# Altium project cam_FX3.PrjPcb
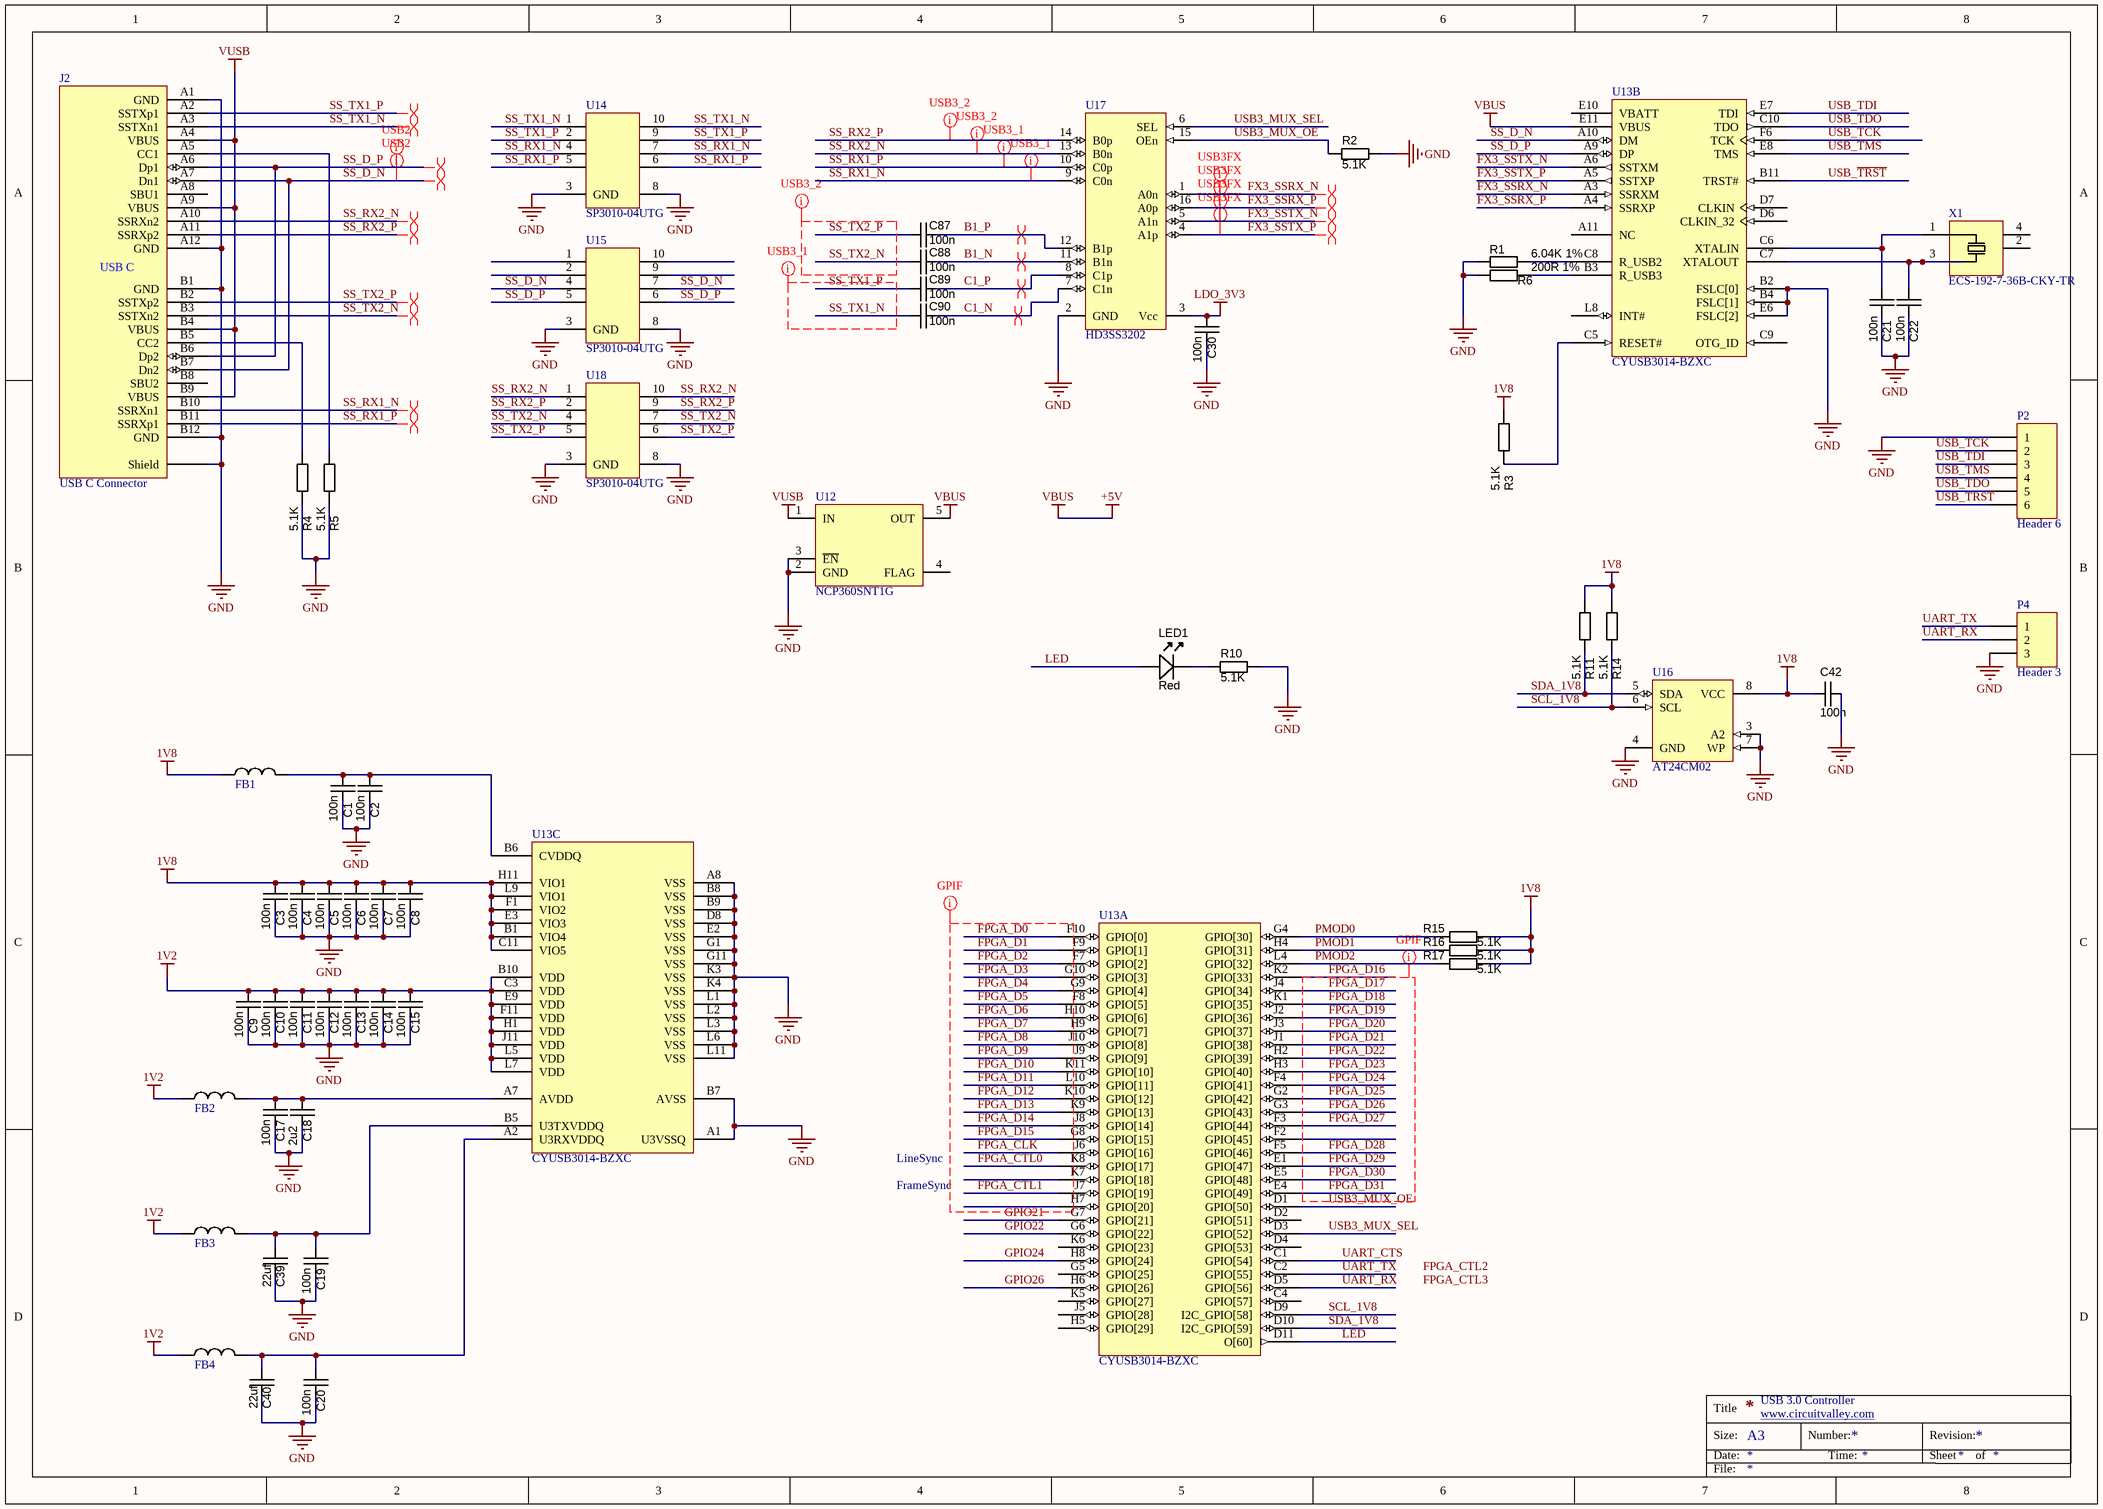
[diagram p0: usb.SchDoc]
3 sheets, 79 parts. Net scope: global (net labels, ports and power ports of the same name join across sheets).
Board file: cam_FX3.PcbDoc
Sheets:
  usb.SchDoc
  power.SchDoc
  camera.SchDoc

## Sheet usb.SchDoc
size A3

### Parts
C1  100n  [CAPC1005N]
C2  100n  [CAPC1005N]
C3  100n  [CAPC1005N]
C4  100n  [CAPC1005N]
C5  100n  [CAPC1005N]
C6  100n  [CAPC1005N]
C7  100n  [CAPC1005N]
C8  100n  [CAPC1005N]
C9  100n  [CAPC1005N]
C10  100n  [CAPC1005N]
C11  100n  [CAPC1005N]
C12  100n  [CAPC1005N]
C13  100n  [CAPC1005N]
C14  100n  [CAPC1005N]
C15  100n  [CAPC1005N]
C17  100n  [CAPC1005N]
C18  2u2  [CAPC1005N]
C19  100n  [CAPC1005N]
C20  100n  [CAPC1005N]
C21  100n  [CAPC1005N]
C22  100n  [CAPC1005N]
C30  100n  [CAPC1005N]
C39  value 22uf  [CAPC1608N]  (hidden comment: approved sub OK)
C40  value 22uf  [CAPC1608N]  (hidden comment: approved sub OK)
C42  100n  [CAPC1005N]
C87  100n  [CAPC1005N]
C88  100n  [CAPC1005N]
C89  100n  [CAPC1005N]
C90  100n  [CAPC1005N]
FB1  Ferrite  [INDC1608N]  (value not drawn)
FB2  Ferrite  [INDC1608N]  (value not drawn)
FB3  Ferrite  [INDC1608N]  (value not drawn)
FB4  Ferrite  [INDC1608N]  (value not drawn)
J2  USB C Connector  [10132328-10001LF]
LED1  Red  [LED-0603-RED]
P2  Header 6  [SMD_Solder_points_1.27]
P4  Header 3  [SMD_3Solder_points_1.27]
R1  value 6.04K 1%  [RESC1005N]  (hidden comment: 6.04K)
R2  value 5.1K  [RESC1005N]  (hidden comment: Thick Film)
R3  value 5.1K  [RESC1005N]  (hidden comment: Thick Film)
R4  value 5.1K  [RESC1005N]  (hidden comment: Thick Film)
R5  value 5.1K  [RESC1005N]  (hidden comment: Thick Film)
R6  value 200R 1%  [RESC1005N]  (hidden comment: 6.04K)
R10  value 5.1K  [RESC1005N]  (hidden comment: Thick Film)
R11  value 5.1K  [RESC1005N]  (hidden comment: Thick Film)
R14  value 5.1K  [RESC1005N]  (hidden comment: Thick Film)
R15  value 5.1K  [RESC1005N]  (hidden comment: Thick Film)
R16  value 5.1K  [RESC1005N]  (hidden comment: Thick Film)
R17  value 5.1K  [RESC1005N]  (hidden comment: Thick Film)
U12  NCP360SNT1G  [SOT23-5]
U13  CYUSB3014-BZXC  [CYP-BZX121]  (parts A,B,C of 3)
U14  SP3010-04UTG  [uDFN-10]
U15  SP3010-04UTG  [uDFN-10]
U16  AT24CM02  [SOIC8]
U17  HD3SS3202  [UQFN-16]
U18  SP3010-04UTG  [uDFN-10]
X1  ECS-192-7-36B-CKY-TR  [Active Oscillator 2520]

### Nets
1V2: C9.2 C10.2 C11.2 C12.2 C13.2 C14.2 C15.2 FB2.1 FB3.1 FB4.1 U13.B10(VDD) U13.C3(VDD) U13.E9(VDD) U13.F11(VDD) U13.H1(VDD) U13.J11(VDD) U13.L5(VDD) U13.L7(VDD)
1V8: C3.2 C4.2 C5.2 C6.2 C7.2 C8.2 C42.2 FB1.1 R3.1 R11.1 R14.1 R15.2 R16.2 R17.2 U13.B1(VIO4) U13.C11(VIO5) U13.E3(VIO3) U13.F1(VIO2) U13.H11(VIO1) U13.L9(VIO1) U16.8(VCC)
+5V: U12.5(OUT) U13.E11(VBUS)  [also labelled VBUS]
GND: C1.1 C2.1 C3.1 C4.1 C5.1 C6.1 C7.1 C8.1 C9.1 C10.1 C11.1 C12.1 C13.1 C14.1 C15.1 C17.1 C18.1 C19.1 C20.1 C21.2 C22.2 C30.1 C39.2 C40.2 C42.1 J2.0(Shield) J2.A1(GND) J2.A12(GND) J2.B1(GND) J2.B12(GND) P2.1 P4.3 R1.1 R2.2 R4.2 R5.2 R6.1 R10.2 U12.2(GND) U12.3(~{EN}) U13.A1(U3VSSQ) U13.A8(VSS) U13.B2(FSLC[0]) U13.B4(FSLC[1]) U13.B7(AVSS) U13.B8(VSS) U13.B9(VSS) U13.D8(VSS) U13.E2(VSS) U13.E6(FSLC[2]) U13.G1(VSS) U13.G11(VSS) U13.K3(VSS) U13.K4(VSS) U13.L1(VSS) U13.L2(VSS) U13.L3(VSS) U13.L6(VSS) U13.L11(VSS) U14.3(GND) U14.8(GND) U15.3(GND) U15.8(GND) U16.3(A2) U16.4(GND) U16.7(WP) U17.2(GND) U18.3(GND) U18.8(GND)
LDO_3V3: C30.2 U17.3(Vcc)
VUSB: J2.A4(VBUS) J2.A9(VBUS) J2.B4(VBUS) J2.B9(VBUS) U12.1(IN)
B1_N: C88.2 U17.11(B1n)
B1_P: C87.2 U17.12(B1p)
C1_N: C90.2 U17.7(C1n)
C1_P: C89.2 U17.8(C1p)
FPGA_CLK: U13.J6(GPIO[16])
FPGA_CTL0: U13.K8(GPIO[17])
FPGA_CTL1: U13.J7(GPIO[19])
FPGA_D0: U13.F10(GPIO[0])
FPGA_D1: U13.F9(GPIO[1])
FPGA_D2: U13.F7(GPIO[2])
FPGA_D3: U13.G10(GPIO[3])
FPGA_D4: U13.G9(GPIO[4])
FPGA_D5: U13.F8(GPIO[5])
FPGA_D6: U13.H10(GPIO[6])
FPGA_D7: U13.H9(GPIO[7])
FPGA_D8: U13.J10(GPIO[8])
FPGA_D9: U13.J9(GPIO[9])
FPGA_D10: U13.K11(GPIO[10])
FPGA_D11: U13.L10(GPIO[11])
FPGA_D12: U13.K10(GPIO[12])
FPGA_D13: U13.K9(GPIO[13])
FPGA_D14: U13.J8(GPIO[14])
FPGA_D15: U13.G8(GPIO[15])
FPGA_D16: U13.K2(GPIO[33])
FPGA_D17: U13.J4(GPIO[34])
FPGA_D18: U13.K1(GPIO[35])
FPGA_D19: U13.J2(GPIO[36])
FPGA_D20: U13.J3(GPIO[37])
FPGA_D21: U13.J1(GPIO[38])
FPGA_D22: U13.H2(GPIO[39])
FPGA_D23: U13.H3(GPIO[40])
FPGA_D24: U13.F4(GPIO[41])
FPGA_D25: U13.G2(GPIO[42])
FPGA_D26: U13.G3(GPIO[43])
FPGA_D27: U13.F3(GPIO[44])
FPGA_D28: U13.F5(GPIO[46])
FPGA_D29: U13.E1(GPIO[47])
FPGA_D30: U13.E5(GPIO[48])
FPGA_D31: U13.E4(GPIO[49])
FX3_SSRX_N: U13.A3(SSRXM) U17.1(A0n)
FX3_SSRX_P: U13.A4(SSRXP) U17.16(A0p)
FX3_SSTX_N: U13.A6(SSTXM) U17.5(A1n)
FX3_SSTX_P: U13.A5(SSTXP) U17.4(A1p)
GPIO21: U13.G7(GPIO[21])
GPIO22: U13.G6(GPIO[22])
GPIO24: U13.H8(GPIO[24])
GPIO26: U13.H6(GPIO[26])
LED: LED1.A U13.D11(O[60])
PMOD0: R15.1 U13.G4(GPIO[30])
PMOD1: R16.1 U13.H4(GPIO[31])
PMOD2: R17.1 U13.L4(GPIO[32])
SCL_1V8: R14.2 U13.D9(I2C_GPIO[58]) U16.6(SCL)
SDA_1V8: R11.2 U13.D10(I2C_GPIO[59]) U16.5(SDA)
SS_D_N: J2.A7(Dn1) J2.B7(Dn2) U13.A10(DM) U15.4 U15.7
SS_D_P: J2.A6(Dp1) J2.B6(Dp2) U13.A9(DP) U15.5 U15.6
SS_RX1_N: J2.B10(SSRXn1) U14.4 U14.7 U17.9(C0n)
SS_RX1_P: J2.B11(SSRXp1) U14.5 U14.6 U17.10(C0p)
SS_RX2_N: J2.A10(SSRXn2) U17.13(B0n) U18.1 U18.10
SS_RX2_P: J2.A11(SSRXp2) U17.14(B0p) U18.2 U18.9
SS_TX1_N: C90.1 J2.A3(SSTXn1) U14.1 U14.10
SS_TX1_P: C89.1 J2.A2(SSTXp1) U14.2 U14.9
SS_TX2_N: C88.1 J2.B3(SSTXn2) U18.4 U18.7
SS_TX2_P: C87.1 J2.B2(SSTXp2) U18.5 U18.6
UART_CTS: U13.C1(GPIO[54])
UART_RX: P4.2 U13.D5(GPIO[56])
UART_TX: P4.1 U13.C2(GPIO[55])
USB3_MUX_OE: R2.1 U13.D1(GPIO[50]) U17.15(OEn)
USB3_MUX_SEL: U13.D3(GPIO[52]) U17.6(SEL)
USB_~{TRST}: P2.6 U13.B11(TRST#)
USB_TCK: P2.2 U13.F6(TCK)
USB_TDI: P2.3 U13.E7(TDI)
USB_TDO: P2.5 U13.C10(TDO)
USB_TMS: P2.4 U13.E8(TMS)
NetC1_2: C1.2 C2.2 FB1.2 U13.B6(CVDDQ)
NetC17_2: C17.2 C18.2 FB2.2 U13.A7(AVDD)
NetC19_2: C19.2 C39.1 FB3.2 U13.B5(U3TXVDDQ)
NetC20_2: C20.2 C40.1 FB4.2 U13.A2(U3RXVDDQ)
NetC21_1: C21.1 U13.C6(XTALIN) X1.1(X1)
NetC22_1: C22.1 U13.C7(XTALOUT) X1.3(X2)
NetJ2_A5: J2.A5(CC1) R5.1
NetJ2_B5: J2.B5(CC2) R4.1
NetLED1_K: LED1.K R10.1
NetR1_2: R1.2 U13.C8(R_USB2)
NetR3_2: R3.2 U13.C5(RESET#)
NetR6_2: R6.2 U13.B3(R_USB3)

Not connected (* = marked no-connect by the designer): J2 A8(SBU1) B8(SBU2); U12 4(FLAG); U13 A11(NC) C4(GPIO[57]) C9(OTG_ID) D2(GPIO[51]) D4(GPIO[53]) D6(CLKIN_32) D7(CLKIN) E10(VBATT) F2(GPIO[45]) G5(GPIO[25]) H5(GPIO[29]) H7(GPIO[20]) J5(GPIO[28]) K5(GPIO[27]) K6(GPIO[23]) K7(GPIO[18]) L8(INT#); U15 1 2 9 10; X1 2(NC) 4(NC)

### Layout directives
differential pair: B1_N, B1_P, C1_N, C1_P, FX3_SSRX_N, FX3_SSRX_P, FX3_SSTX_N, FX3_SSTX_P, SS_D_N, SS_D_P, SS_RX1_N, SS_RX1_P, SS_RX2_N, SS_RX2_P, SS_TX1_N, SS_TX1_P, SS_TX2_N, SS_TX2_P
net class USB2: SS_D_N, SS_D_P
net class USB3FX: FX3_SSRX_N, FX3_SSRX_P, FX3_SSTX_N, FX3_SSTX_P
net class USB3_2: SS_RX2_N, SS_RX2_P, SS_TX2_N, SS_TX2_P
net class USB3_1: SS_RX1_N, SS_RX1_P, SS_TX1_N, SS_TX1_P
net class GPIF: FPGA_CLK, FPGA_CTL0, FPGA_CTL1, FPGA_D0, FPGA_D1, FPGA_D2, FPGA_D3, FPGA_D4, FPGA_D5, FPGA_D6, FPGA_D7, FPGA_D8, FPGA_D9, FPGA_D10, FPGA_D11, FPGA_D12, FPGA_D13, FPGA_D14, FPGA_D15, FPGA_D16, FPGA_D17, FPGA_D18, FPGA_D19, FPGA_D20, FPGA_D21, FPGA_D22, FPGA_D23, FPGA_D24, FPGA_D25, FPGA_D26, FPGA_D27, FPGA_D28, FPGA_D29, FPGA_D30, FPGA_D31

### Notes on the sheet
- LineSync
- FrameSync
- USB 3.0 Controller
- www.circuitvalley.com <http://www.circuitvalley.com>
- Labels drawn without touching a wire or pin: FPGA_CTL2, FPGA_CTL3
- Title
- Size:
- Date:
- A3
- Number:
- Time:
- Revision:
- Sheet
- of
- File:
- (in symbol USB_C) USB C

### Library data of the parts
C1-C15 C17-C22 C30 C42 C87-C90 = CAPC_10n_0402_16V_10%: Capacitor SMD Cer 10nF 10% 16V X7R 0402; Manufacturer 1: AVX Corporation; Manufacturer Part Number 1: 0402YC103KAT2A; Ratings: 16V; X7R; Tolerance: ±10%; Operating Temperature: -55°C ~ 125°C; Package / Case: 0402 (1005 Metric); Size / Dimension: 0.039" L x 0.020" W (1.00mm x 0.50mm); Manufacturer 2: Yageo; Manufacturer Part Number 2: CC0402KRX7R7BB103; Supplier 1: Digi-Key; Supplier Part Number 1: 478-1114-1-ND; ComponentLink1URL: http://www.avx.com/docs/Catalogs/cx7r.pdf; ComponentLink1Description: http://www.avx.com/docs/Catalogs/cx7r.pdf; Supplier 2: Digi-Key; Supplier Part Number 2: 311-1042-1-ND; ComponentLink2URL: http://www.yageo.com/documents/recent/UPY-GPHC_X7R_6.3V-to-50V_8.pdf; ComponentLink2Description: http://www.yageo.com/documents/recent/UPY-GPHC_X7R_6.3V-to-50V_8.pdf
  C1-C15 C17 C19-C22 C30 C42 C87-C90: Value: 100n
  C18: Value: 2u2
C39 C40 = CAPC_560p_0603_5%: Capacitor SMD Cer 560pF 5% 50V NP0 0603; Manufacturer 1: AVX Corporation; Manufacturer Part Number 1: 06035A561JAT2A; Ratings: 50V; NP0; Material: ceramic; Capacitance: 470pF; Package / Case: 0603 (1608 metric); Voltage - Rated: 50V; Mounting Type: Surface Mount, MLCC; Operating Temperature: -55°C ~ 125°C; Applications: General Purpose; Size / Dimension: 0.063" L x 0.032" W (1.60mm x 0.81mm); Height - Seated (Max): -; Thickness (Max): 0.035" (0.90mm); Lead Spacing: -; Lead Style: -; ComponentLink1URL: http://www.avx.com/docs/Catalogs/ccog.pdf; ComponentLink1Description: http://www.avx.com/docs/Catalogs/ccog.pdf; Supplier 1: Digi-Key; Supplier Part Number 1: 478-1184-1-ND
J2 = USB_C
LED1 = LED_SMD_Red_0603_220mcd: LED 0603 SMD Hyper Red 630nm 220mcd 20mA; Manufacturer 1: Kingbright Corp; Manufacturer Part Number 1: APT1608SURCK; Material: AlGaInP on GaAs; Ratings: 220 mcd; 630 nm; Voltage - Forward (Vf) Typ: 1.95V; Voltage - Forward (Vf) @ 10mA: 1.9V; Package / Case: 0603 (1608 metric); Supplier 1: Digi-Key; Supplier Part Number 1: 754-1123-1-ND
P2 = Header 6: Header, 6-Pin; LatestRevisionDate: 17-Jul-2002; LatestRevisionNote: Re-released for DXP Platform.; Publisher: Altium Limited
P4 = Header 3: Header, 3-Pin; LatestRevisionDate: 17-Jul-2002; LatestRevisionNote: Re-released for DXP Platform.; Publisher: Altium Limited
R1-R6 R10 R11 R14-R17 = RES_3K3_0402_5%: Resistor SMD chip 3.3k Ohm 0.063W 5% 0402; Manufacturer 1: Yageo; Manufacturer Part Number 1: RC0402JR-073K3L; Ratings: 1/16 W; Package / Case: 0402 (1005 metric); Tolerance: ±5%; Material: Thick Film; Supplier 1: Digi-Key; Supplier Part Number 1: 311-3.3KJRCT-ND; ComponentLink1URL: http://www.yageo.com/documents/recent/PYu-RC0402_51_RoHS_L_6.pdf; ComponentLink1Description: http://www.yageo.com/documents/recent/PYu-RC0402_51_RoHS_L_6.pdf
U12 = NCP360SNT1G: USB Overvoltage Protection
U13 = CYUSB3014-BZXC: EZ-USB(R) FX3: SuperSpeed USB Controller, 512 KB, 60 I/Os, 0 to 70 degC, 121-Pin FBGA (BZX121); Manufacturer: Cypress; CPU Core: ARM926 EJ-S; Max. Operating Voltage (V): 1.25; Memory Architecture: SRAM; Memory Size (KB): 512; Min. Operating Voltage (V): 1.15; No. of I/Os: 60; DatasheetVersion: Rev. *O; PackageVersion: Rev. *D; PackageReference: BZX121; PackageDescription: 121-Ball FBGA, Body 10 x 10 mm, Pitch 0.8 mm; Supplier 1: Digi-Key; Supplier Part Number 1: 428-3182-ND; Supplier 2: Farnell; Supplier Part Number 2: 2355789; Supplier 3: Newark; Supplier Part Number 3: 54W7901; Supplier 4: Mouser; Supplier Part Number 4: 727-CYUSB3014-BZXC; Max. Operating Temp. (degreesC): 70; Min. Operating Temp. (degreesC): 0; RoHS: Pb-Free; Mounting Technology: Surface Mount; Code_JEDEC: PUB 95; PartNumber: CYUSB3014-BZXC; ComponentLink1Description: Manufacturer URL; ComponentLink1URL: http://www.cypress.com/; ComponentLink2Description: Datasheet; ComponentLink2URL: http://www.cypress.com/?docID=49087; ComponentLink3Description: Package Specification; ComponentLink3URL: http://www.cypress.com/?docID=45795
U14 U15 U18 = SP3010-04UTG: ESD Protection
U16 = AT24CM02: 2Mbit I2C EEPROM
U17 = HD3SS3202: USB 3.0 Mux
X1 = Crystal: Crystal Oscillator

## Sheet power.SchDoc
size A3
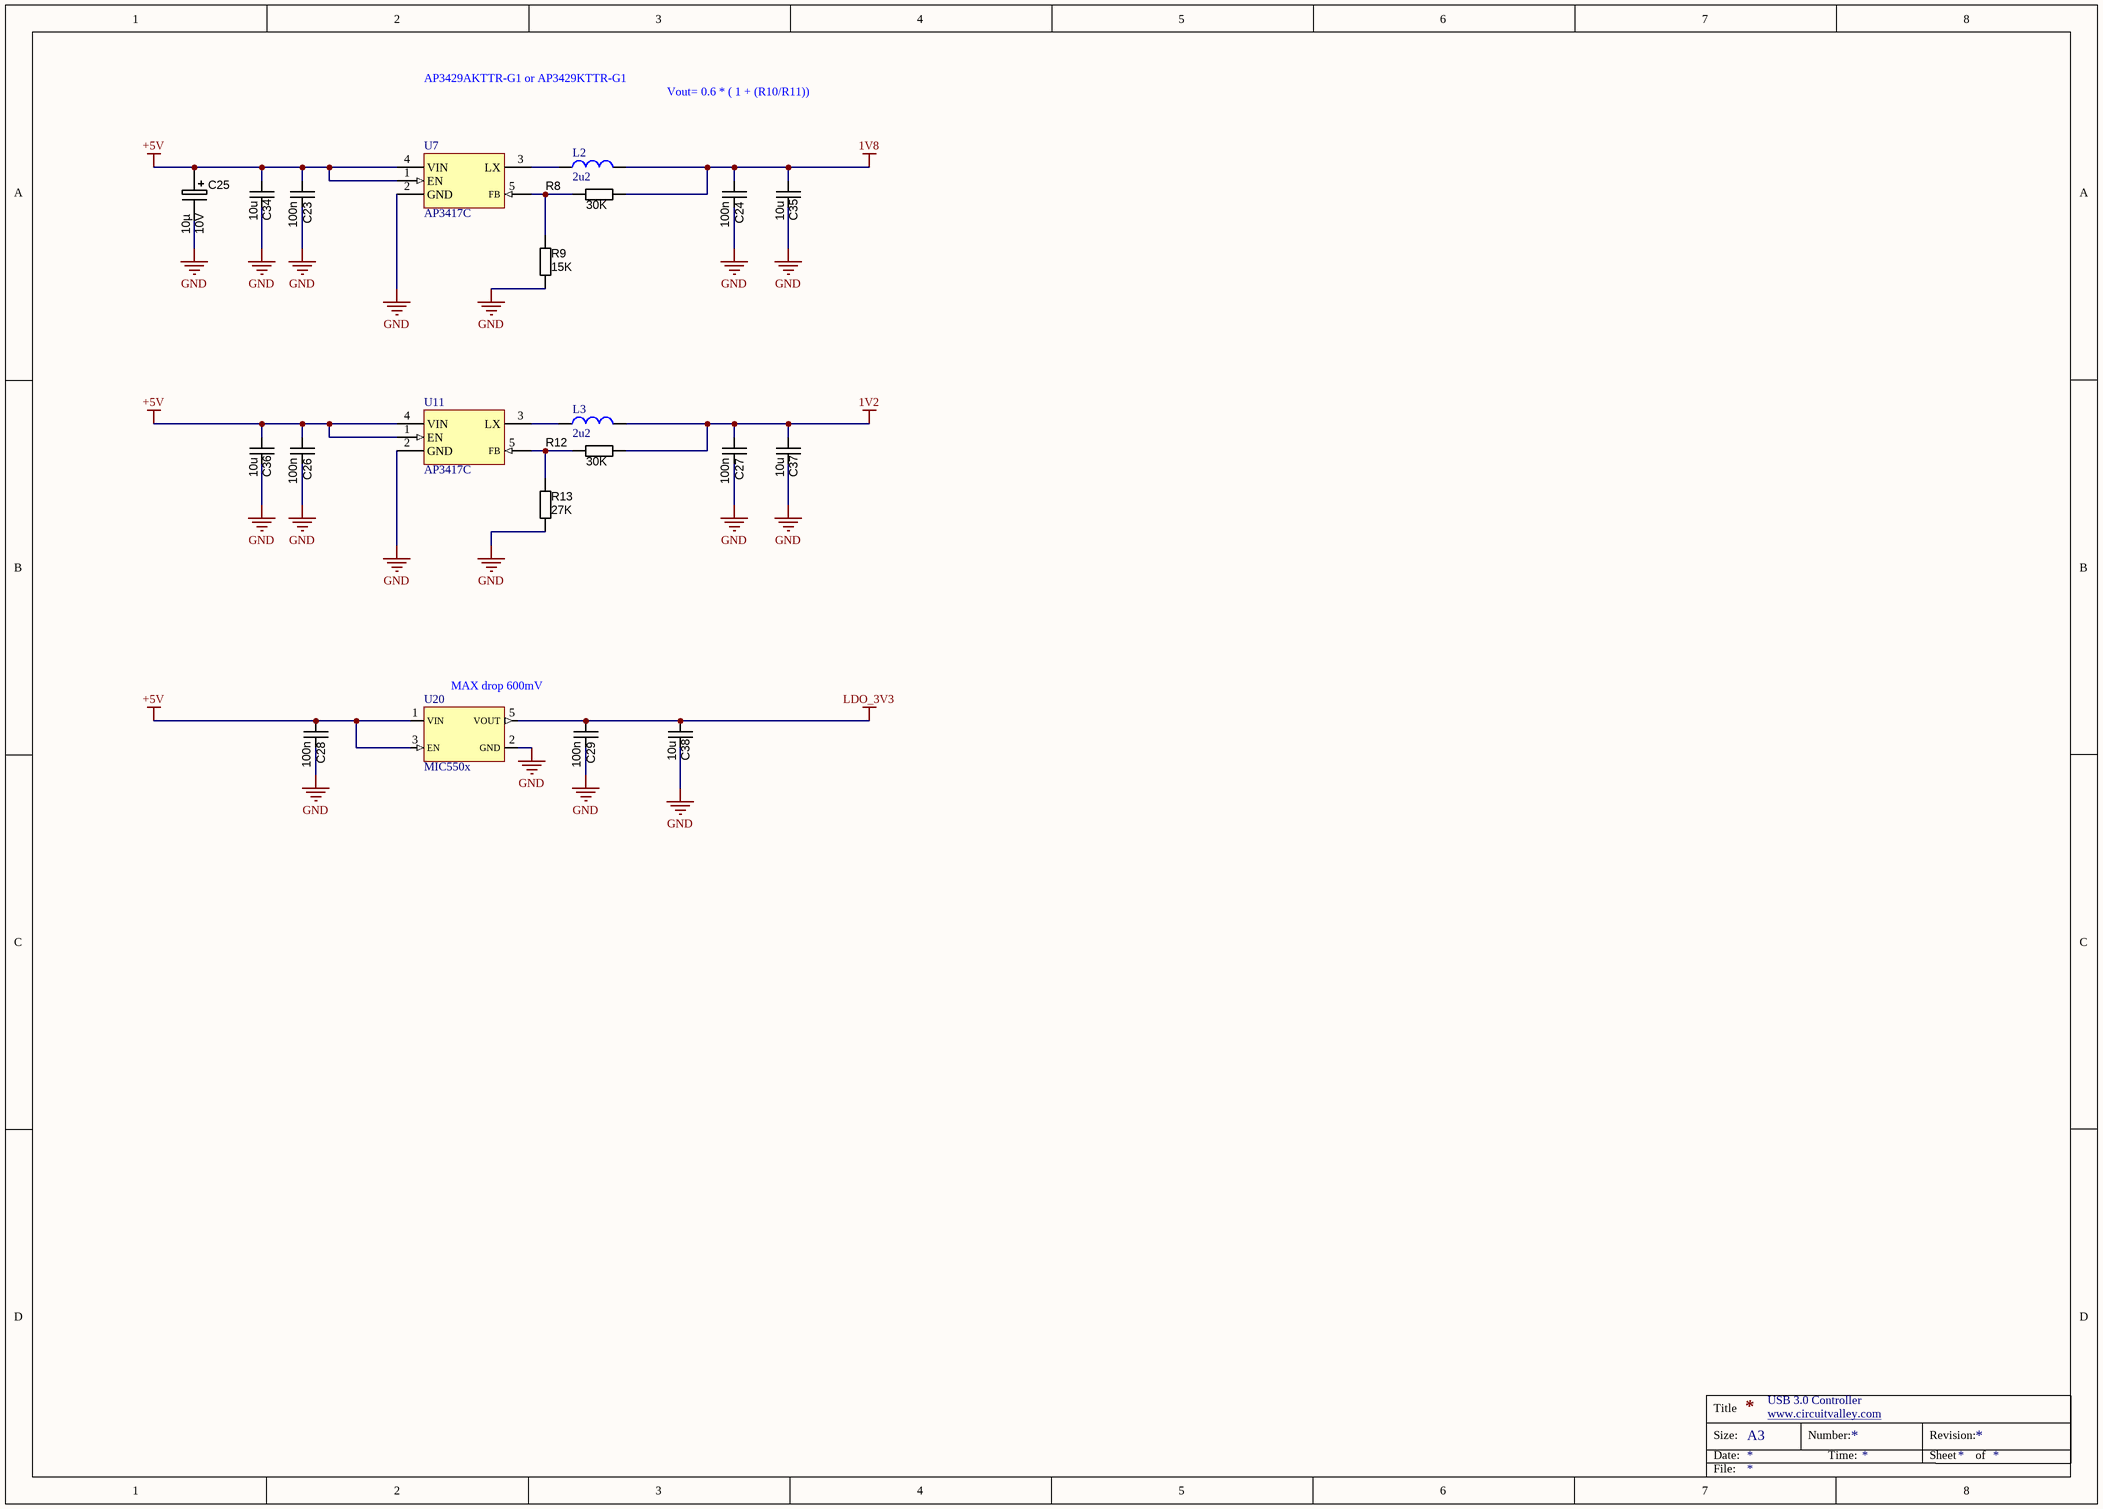
[diagram p1: power.SchDoc]

### Parts
C23  100n  [CAPC1005N]
C24  100n  [CAPC1005N]
C25  Ratings: 10V  [CAPMP3528X210N]  (hidden comment: 10µ)
C26  100n  [CAPC1005N]
C27  100n  [CAPC1005N]
C28  100n  [CAPC1005N]
C29  100n  [CAPC1005N]
C34  value 10u  [CAPC1608N]  (hidden comment: approved sub OK)
C35  value 10u  [CAPC1608N]  (hidden comment: approved sub OK)
C36  value 10u  [CAPC1608N]  (hidden comment: approved sub OK)
C37  value 10u  [CAPC1608N]  (hidden comment: approved sub OK)
C38  value 10u  [CAPC1608N]  (hidden comment: approved sub OK)
L2  2u2  [FDSD0420-H-2R2M]
L3  2u2  [FDSD0420-H-2R2M]
R8  value 30K  [RESC1005N]  (hidden comment: Thick Film)
R9  value 15K  [RESC1005N]  (hidden comment: Thick Film)
R12  value 30K  [RESC1005N]  (hidden comment: Thick Film)
R13  value 27K  [RESC1005N]  (hidden comment: Thick Film)
U7  AP3417C  [SOT23-5]
U11  AP3417C  [SOT23-5]
U20  MIC550x  [SOT23-5]

### Nets
1V2: C27.2 C37.1 L3.2 R12.2
1V8: C24.2 C35.1 L2.2 R8.2
+5V: C23.2 C25.1 C26.2 C28.2 C34.1 C36.1 U7.1(EN) U7.4(VIN) U11.1(EN) U11.4(VIN) U20.1(VIN) U20.3(EN)
GND: C23.1 C24.1 C25.2 C26.1 C27.1 C28.1 C29.1 C34.2 C35.2 C36.2 C37.2 C38.2 R9.2 R13.1 U7.2(GND) U11.2(GND) U20.2(GND)
LDO_3V3: C29.2 C38.1 U20.5(VOUT)
NetL2_1: L2.1 U7.3(LX)
NetL3_1: L3.1 U11.3(LX)
NetR8_1: R8.1 R9.1 U7.5(FB)
NetR12_1: R12.1 R13.2 U11.5(FB)

### Notes on the sheet
- AP3429AKTTR-G1 or AP3429KTTR-G1
- Vout= 0.6 * ( 1 + (R10/R11))
- (near U20) MAX drop 600mV
- USB 3.0 Controller
- www.circuitvalley.com <http://www.circuitvalley.com>
- Title
- Size:
- Date:
- A3
- Number:
- Time:
- Revision:
- Sheet
- of
- File:

### Library data of the parts
C23 C24 C26-C29 = CAPC_10n_0402_16V_10%: as C1 on sheet usb; Tolerance: ±10%; Operating Temperature: -55°C ~ 125°C; Package / Case: 0402 (1005 Metric); Size / Dimension: 0.039" L x 0.020" W (1.00mm x 0.50mm); Manufacturer 2: Yageo; Manufacturer Part Number 2: CC0402KRX7R7BB103; Supplier 1: Digi-Key; Supplier Part Number 1: 478-1114-1-ND; ComponentLink1URL: http://www.avx.com/docs/Catalogs/cx7r.pdf; ComponentLink1Description: http://www.avx.com/docs/Catalogs/cx7r.pdf; Supplier 2: Digi-Key; Supplier Part Number 2: 311-1042-1-ND; ComponentLink2URL: http://www.yageo.com/documents/recent/UPY-GPHC_X7R_6.3V-to-50V_8.pdf; ComponentLink2Description: http://www.yageo.com/documents/recent/UPY-GPHC_X7R_6.3V-to-50V_8.pdf; Value: 100n
C25 = CAPT_47u_1210_6V3: Capacitor SMD Tantalum 47uF 20% 6.3V 1210; Manufacturer 1: AVX Corporation; Manufacturer Part Number 1: TCJB476M006R0070; Manufacturer Size Code: B; Voltage - Rated: 6V3; ESR (Equivalent Series Resistance): 70.0 mOhm; Type: Molded; Package / Case: 1210 (3528 Metric); Tolerance: ±20%; Material: Tantalum; Supplier 1: Digi-Key; Supplier Part Number 1: 478-3139-1-ND; Operating Temperature: -55°C ~ 125°C; Size / Dimension: 0.138" L x 0.110" W (3.50mm x 2.80mm); Height - Seated (Max): 0.083" (2.10mm); ComponentLink1URL: http://www.avx.com/docs/Catalogs/tcj.pdf; ComponentLink1Description: http://www.avx.com/docs/Catalogs/tcj.pdf; Value: 10µ
C34-C38 = CAPC_560p_0603_5%: as C39 on sheet usb; Package / Case: 0603 (1608 metric); Voltage - Rated: 50V; Mounting Type: Surface Mount, MLCC; Operating Temperature: -55°C ~ 125°C; Applications: General Purpose; Size / Dimension: 0.063" L x 0.032" W (1.60mm x 0.81mm); Height - Seated (Max): -; Thickness (Max): 0.035" (0.90mm); Lead Spacing: -; Lead Style: -; ComponentLink1URL: http://www.avx.com/docs/Catalogs/ccog.pdf; ComponentLink1Description: http://www.avx.com/docs/Catalogs/ccog.pdf; Supplier 1: Digi-Key; Supplier Part Number 1: 478-1184-1-ND
L2 L3 = inductor_smd
R8 R9 R12 R13 = RES_3K3_0402_5%: as R1 on sheet usb; Package / Case: 0402 (1005 metric); Tolerance: ±5%; Material: Thick Film; Supplier 1: Digi-Key; Supplier Part Number 1: 311-3.3KJRCT-ND; ComponentLink1URL: http://www.yageo.com/documents/recent/PYu-RC0402_51_RoHS_L_6.pdf; ComponentLink1Description: http://www.yageo.com/documents/recent/PYu-RC0402_51_RoHS_L_6.pdf

## Sheet camera.SchDoc
size A3
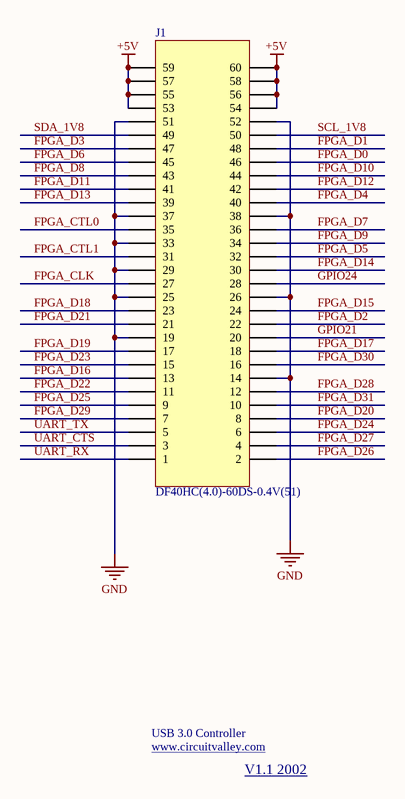
[diagram p2: camera.SchDoc]

### Parts
J1  DF40HC(4.0)-60DS-0.4V(51)  [DF40HC(4.0)-60DS-0.4V(51)]

### Nets
+5V: J1.53 J1.54 J1.55 J1.56 J1.57 J1.58 J1.59 J1.60
GND: J1.14 J1.19 J1.25 J1.26 J1.29 J1.33 J1.37 J1.38 J1.51 J1.52
FPGA_CLK: J1.27
FPGA_CTL0: J1.35
FPGA_CTL1: J1.31
FPGA_D0: J1.46
FPGA_D1: J1.48
FPGA_D2: J1.22
FPGA_D3: J1.47
FPGA_D4: J1.40
FPGA_D5: J1.32
FPGA_D6: J1.45
FPGA_D7: J1.36
FPGA_D8: J1.43
FPGA_D9: J1.34
FPGA_D10: J1.44
FPGA_D11: J1.41
FPGA_D12: J1.42
FPGA_D13: J1.39
FPGA_D14: J1.30
FPGA_D15: J1.24
FPGA_D16: J1.13
FPGA_D17: J1.18
FPGA_D18: J1.23
FPGA_D19: J1.17
FPGA_D20: J1.8
FPGA_D21: J1.21
FPGA_D22: J1.11
FPGA_D23: J1.15
FPGA_D24: J1.6
FPGA_D25: J1.9
FPGA_D26: J1.2
FPGA_D27: J1.4
FPGA_D28: J1.12
FPGA_D29: J1.7
FPGA_D30: J1.16
FPGA_D31: J1.10
GPIO21: J1.20
GPIO24: J1.28
SCL_1V8: J1.50
SDA_1V8: J1.49
UART_CTS: J1.3
UART_RX: J1.1
UART_TX: J1.5

### Notes on the sheet
- USB 3.0 Controller
- www.circuitvalley.com <http://www.circuitvalley.com>
- V1.1 2002
- Title
- Size:
- Date:
- A3
- Number:
- Time:
- Revision:
- Sheet
- of
- File:

### Library data of the parts
J1 = DF40HC(4.0)-60DS-0.4V(51): Hiros 60 pin Connector

## Nets that join several sheets
1V2: usb (18 pins), power (C27.2 C37.1 L3.2 R12.2)
1V8: usb (21 pins), power (C24.2 C35.1 L2.2 R8.2)
+5V: usb (U12.5 U13.E11), power (12 pins), camera (8 pins)
GND: usb (69 pins), power (17 pins), camera (10 pins)
LDO_3V3: usb (C30.2 U17.3), power (C29.2 C38.1 U20.5)
FPGA_CLK: usb (U13.J6), camera (J1.27)
FPGA_CTL0: usb (U13.K8), camera (J1.35)
FPGA_CTL1: usb (U13.J7), camera (J1.31)
FPGA_D0: usb (U13.F10), camera (J1.46)
FPGA_D1: usb (U13.F9), camera (J1.48)
FPGA_D2: usb (U13.F7), camera (J1.22)
FPGA_D3: usb (U13.G10), camera (J1.47)
FPGA_D4: usb (U13.G9), camera (J1.40)
FPGA_D5: usb (U13.F8), camera (J1.32)
FPGA_D6: usb (U13.H10), camera (J1.45)
FPGA_D7: usb (U13.H9), camera (J1.36)
FPGA_D8: usb (U13.J10), camera (J1.43)
FPGA_D9: usb (U13.J9), camera (J1.34)
FPGA_D10: usb (U13.K11), camera (J1.44)
FPGA_D11: usb (U13.L10), camera (J1.41)
FPGA_D12: usb (U13.K10), camera (J1.42)
FPGA_D13: usb (U13.K9), camera (J1.39)
FPGA_D14: usb (U13.J8), camera (J1.30)
FPGA_D15: usb (U13.G8), camera (J1.24)
FPGA_D16: usb (U13.K2), camera (J1.13)
FPGA_D17: usb (U13.J4), camera (J1.18)
FPGA_D18: usb (U13.K1), camera (J1.23)
FPGA_D19: usb (U13.J2), camera (J1.17)
FPGA_D20: usb (U13.J3), camera (J1.8)
FPGA_D21: usb (U13.J1), camera (J1.21)
FPGA_D22: usb (U13.H2), camera (J1.11)
FPGA_D23: usb (U13.H3), camera (J1.15)
FPGA_D24: usb (U13.F4), camera (J1.6)
FPGA_D25: usb (U13.G2), camera (J1.9)
FPGA_D26: usb (U13.G3), camera (J1.2)
FPGA_D27: usb (U13.F3), camera (J1.4)
FPGA_D28: usb (U13.F5), camera (J1.12)
FPGA_D29: usb (U13.E1), camera (J1.7)
FPGA_D30: usb (U13.E5), camera (J1.16)
FPGA_D31: usb (U13.E4), camera (J1.10)
GPIO21: usb (U13.G7), camera (J1.20)
GPIO24: usb (U13.H8), camera (J1.28)
SCL_1V8: usb (R14.2 U13.D9 U16.6), camera (J1.50)
SDA_1V8: usb (R11.2 U13.D10 U16.5), camera (J1.49)
UART_CTS: usb (U13.C1), camera (J1.3)
UART_RX: usb (P4.2 U13.D5), camera (J1.1)
UART_TX: usb (P4.1 U13.C2), camera (J1.5)